# Altium schematic sheet SN原理图.SchDoc
size A2
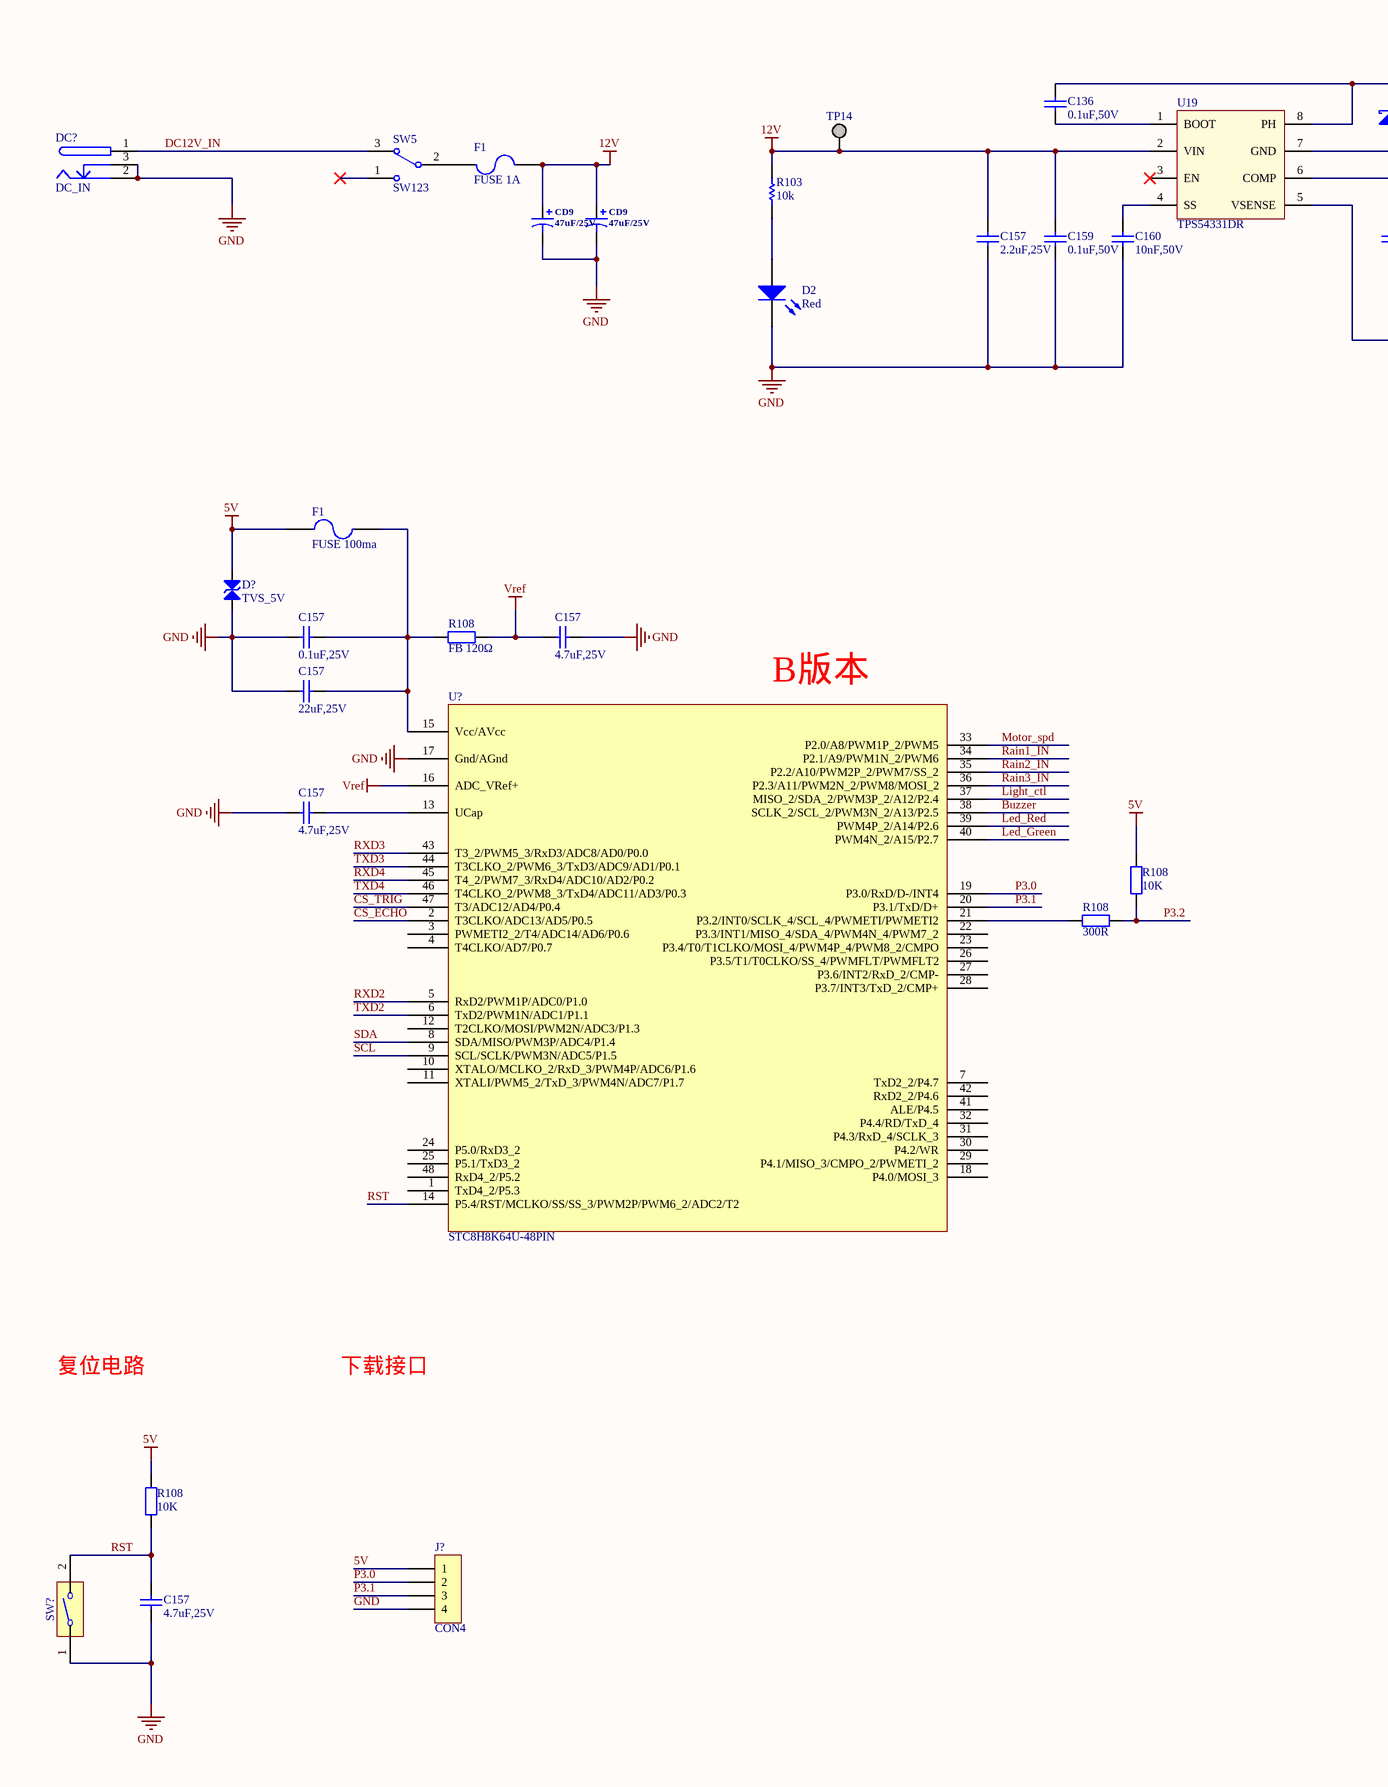
[diagram p0: SN原理图.SchDoc, left]
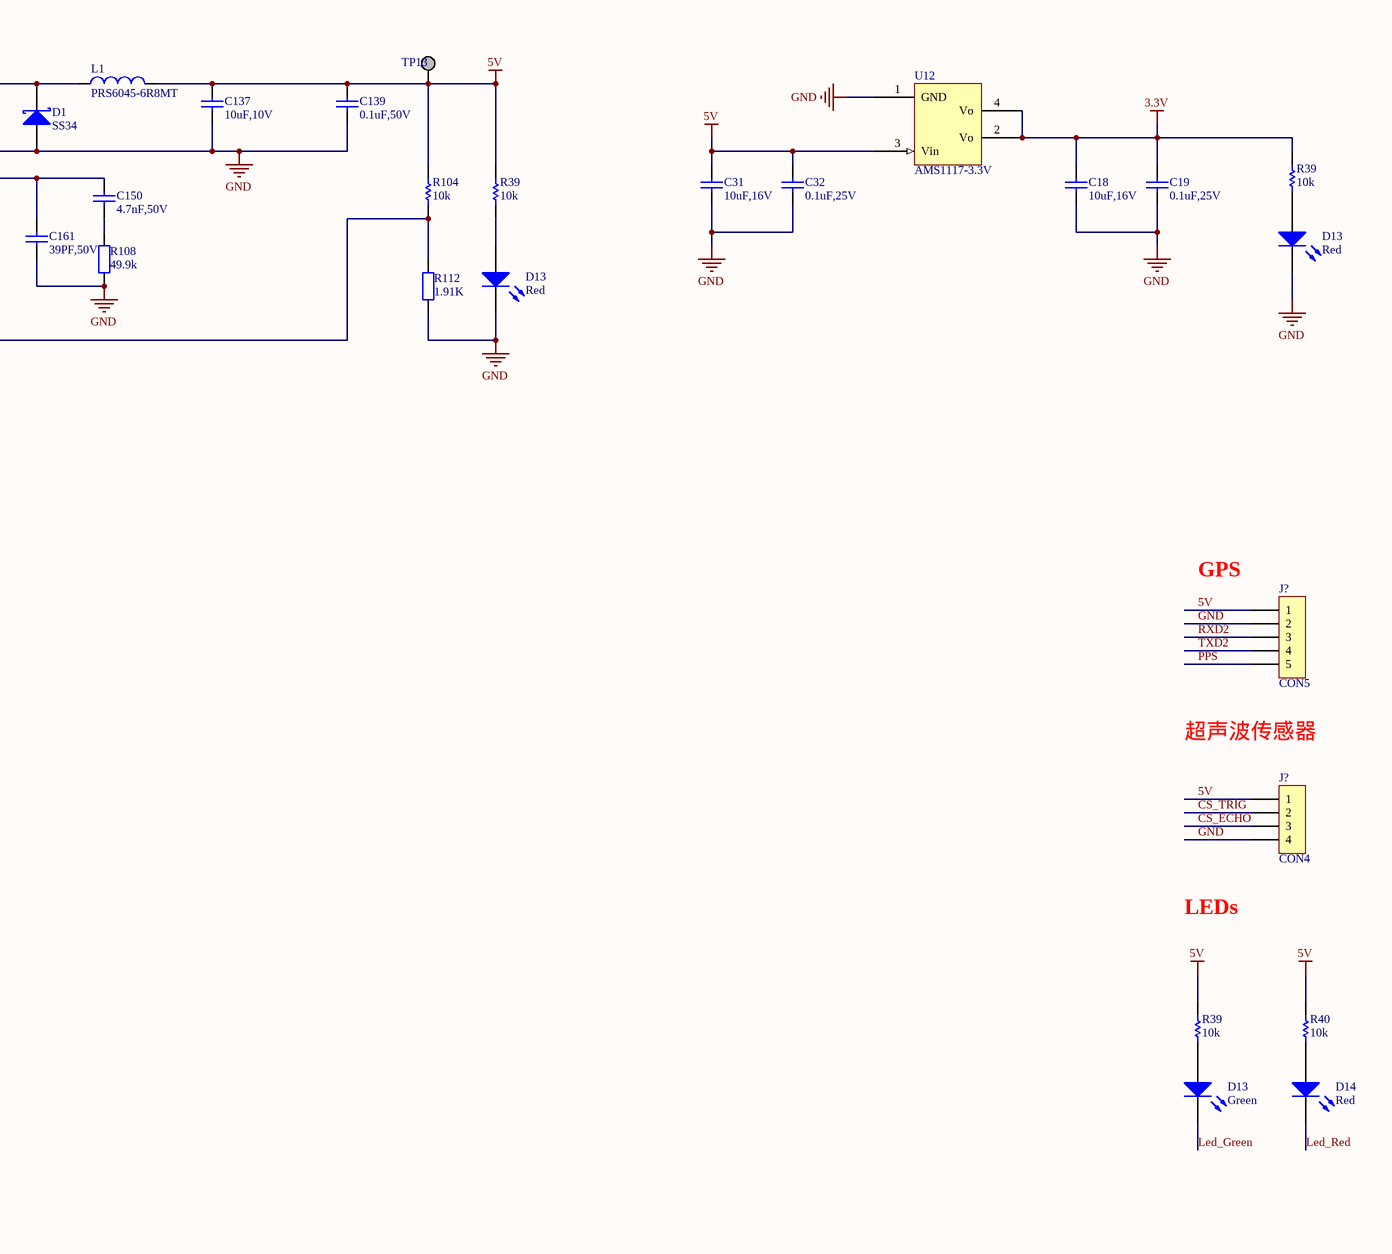
[diagram p1: SN原理图.SchDoc, right]

## Parts
(Parts that share a designator on the sheet are numbered #1, #2 ... from top to bottom, then left to right.)
C18  value 10uF,16V  [0603_C]  (hidden comment: Cap)
C19  value 0.1uF,25V  [0603_C]  (hidden comment: Cap)
C31  value 10uF,16V  [0603_C]  (hidden comment: Cap)
C32  value 0.1uF,25V  [0603_C]  (hidden comment: Cap)
C136  value 0.1uF,50V  [0603_C]  (hidden comment: Cap)
C137  value 10uF,10V  [0603_C]  (hidden comment: Cap)
C139  value 0.1uF,50V  [0603_C]  (hidden comment: Cap)
C150  value 4.7nF,50V  [0603_C]  (hidden comment: Cap)
C157#1  value 2.2uF,25V  [0603_C]  (hidden comment: Cap)
C157#2  value 0.1uF,25V  [0603_C]  (hidden comment: Cap)
C157#3  value 4.7uF,25V  [0603_C]  (hidden comment: Cap)
C157#4  value 22uF,25V  [0603_C]  (hidden comment: Cap)
C157#5  value 4.7uF,25V  [0603_C]  (hidden comment: Cap)
C157#6  value 4.7uF,25V  [0603_C]  (hidden comment: Cap)
C159  value 0.1uF,50V  [0603_C]  (hidden comment: Cap)
C160  value 10nF,50V  [0603_C]  (hidden comment: Cap)
C161  value 39PF,50V  [0603_C]  (hidden comment: Cap)
CD9#1  47uF/25V  [CD7343]
CD9#2  47uF/25V  [CD7343]
D1  value SS34  [DO-214AC]  (hidden comment: Diode Schottky)
D2  value Red  [0603_LED]  (hidden comment: LED)
D13#1  value Red  [0603_LED]  (hidden comment: LED)
D13#2  value Red  [0603_LED]  (hidden comment: LED)
D13#3  value Green  [0603_LED]  (hidden comment: LED)
D14  value Red  [0603_LED]  (hidden comment: LED)
D?  TVS_5V  [SOD-323]
DC?  DC_IN  [PJ-058A]
F1#1  FUSE 1A  [1206_FUSE]
F1#2  FUSE 100ma  [1206_FUSE]
J?#1  CON5
J?#2  CON4
J?#3  CON4
L1  value PRS6045-6R8MT  [IND-SMD_L5.8-W5.2]  (hidden comment: Inductors)
R39#1  value 10k  [0603_R]  (hidden comment: Res_5%)
R39#2  value 10k  [0603_R]  (hidden comment: Res_5%)
R39#3  value 10k  [0603_R]  (hidden comment: Res_5%)
R40  value 10k  [0603_R]  (hidden comment: Res_5%)
R103  value 10k  [0603_R]  (hidden comment: Res_5%)
R104  value 10k  [0603_R]  (hidden comment: Res_5%)
R108#1  value 49.9k  [0603_R]  (hidden comment: Res)
R108#2  value FB 120Ω  [0603_R]  (hidden comment: Res)
R108#3  value 10K  [0603_R]  (hidden comment: Res)
R108#4  value 300R  [0603_R]  (hidden comment: Res)
R108#5  value 10K  [0603_R]  (hidden comment: Res)
R112  value 1.91K  [0603_R]  (hidden comment: Res)
SW5  SW123  [SW-TH_SS-12D10L9]
SW?  (no value)
TP13  TP  [TP_H]  (value not drawn)  (no BOM)
TP14  TP  [TP_H]  (value not drawn)  (no BOM)
U12  value AMS1117-3.3V  [SOT223]  (hidden comment: AMS1117)
U19  TPS54331DR  [SOIC8]
U?  STC8H8K64U-48PIN  [QFN48(6X6mm)]

## Nets
3.3V: C18.2 C19.2 R39#1.2 U12.2(Vo) U12.4(Vo)
5V: C31.2 C32.2 C137.2 C139.2 D?.1 F1#2.2 J?#1.1 J?#2.1 J?#3.1 L1.2 R39#2.2 R39#3.2 R40.2 R104.2 R108#3.1 R108#5.1 TP13.1 U12.3(Vin)
12V: C157#1.2 C159.2 CD9#1.1 CD9#2.1 F1#1.1 R103.2 TP14.1 U19.2(VIN)
GND: C18.1 C19.1 C31.1 C32.1 C137.1 C139.1 C157#1.1 C157#2.1 C157#3.1 C157#4.1 C157#5.2 C157#6.2 C159.1 C160.2 C161.1 CD9#1.2 CD9#2.2 D1.1(A) D2.2(K) D13#1.2(K) D13#2.2(K) D?.2 DC?.2 DC?.3 J?#1.2 J?#2.4 J?#3.4 R108#1.1 R112.1 SW?.1 U12.1(GND) U19.7(GND) U?.17(Gnd/AGnd)
Vref: C157#3.2 R108#2.1 U?.16(ADC_VRef+)
Buzzer: U?.38(SCLK_2/SCL_2/PWM3N_2/A13/P2.5)
CS_ECHO: J?#2.3 U?.2(T3CLKO/ADC13/AD5/P0.5)
CS_TRIG: J?#2.2 U?.47(T3/ADC12/AD4/P0.4)
DC12V_IN: DC?.1 SW5.3
Led_Green: D13#3.2(K) U?.40(PWM4N_2/A15/P2.7)
Led_Red: D14.2(K) U?.39(PWM4P_2/A14/P2.6)
Light_ctl: U?.37(MISO_2/SDA_2/PWM3P_2/A12/P2.4)
Motor_spd: U?.33(P2.0/A8/PWM1P_2/PWM5)
P3.0: J?#3.2 U?.19(P3.0/RxD/D-/INT4)
P3.1: J?#3.3 U?.20(P3.1/TxD/D+)
P3.2: R108#3.2 R108#4.2
PPS: J?#1.5
Rain1_IN: U?.34(P2.1/A9/PWM1N_2/PWM6)
Rain2_IN: U?.35(P2.2/A10/PWM2P_2/PWM7/SS_2)
Rain3_IN: U?.36(P2.3/A11/PWM2N_2/PWM8/MOSI_2)
RST: C157#6.1 R108#5.2 SW?.2 U?.14(P5.4/RST/MCLKO/SS/SS_3/PWM2P/PWM6_2/ADC2/T2)
RXD2: J?#1.3 U?.5(RxD2/PWM1P/ADC0/P1.0)
RXD3: U?.43(T3_2/PWM5_3/RxD3/ADC8/AD0/P0.0)
RXD4: U?.45(T4_2/PWM7_3/RxD4/ADC10/AD2/P0.2)
SCL: U?.9(SCL/SCLK/PWM3N/ADC5/P1.5)
SDA: U?.8(SDA/MISO/PWM3P/ADC4/P1.4)
TXD2: J?#1.4 U?.6(TxD2/PWM1N/ADC1/P1.1)
TXD3: U?.44(T3CLKO_2/PWM6_3/TxD3/ADC9/AD1/P0.1)
TXD4: U?.46(T4CLKO_2/PWM8_3/TxD4/ADC11/AD3/P0.3)
NetC136_1: C136.1 U19.1(BOOT)
NetC136_2: C136.2 D1.2(K) L1.1 U19.8(PH)
NetC150_1: C150.1 R108#1.2
NetC150_2: C150.2 C161.2 U19.6(COMP)
NetC157#2_2: C157#2.2 C157#4.2 F1#2.1 R108#2.2 U?.15(Vcc/AVcc)
NetC157#5_1: C157#5.1 U?.13(UCap)
NetC160_1: C160.1 U19.4(SS)
NetD2_1: D2.1(A) R103.1
NetD13#1_1: D13#1.1(A) R39#1.1
NetD13#2_1: D13#2.1(A) R39#2.1
NetD13#3_1: D13#3.1(A) R39#3.1
NetD14_1: D14.1(A) R40.1
NetF1#1_2: F1#1.2 SW5.2
NetR104_1: R104.1 R112.2 U19.5(VSENSE)
NetR108#4_1: R108#4.1 U?.21(P3.2/INT0/SCLK_4/SCL_4/PWMETI/PWMETI2)

Not connected (* = marked no-connect by the designer): SW5 1*; U19 3(EN)*; U? 1(TxD4_2/P5.3) 3(PWMETI2_2/T4/ADC14/AD6/P0.6) 4(T4CLKO/AD7/P0.7) 7(TxD2_2/P4.7) 10(XTALO/MCLKO_2/RxD_3/PWM4P/ADC6/P1.6) 11(XTALI/PWM5_2/TxD_3/PWM4N/ADC7/P1.7) 12(T2CLKO/MOSI/PWM2N/ADC3/P1.3) 18(P4.0/MOSI_3) 22(P3.3/INT1/MISO_4/SDA_4/PWM4N_4/PWM7_2) 23(P3.4/T0/T1CLKO/MOSI_4/PWM4P_4/PWM8_2/CMPO) 24(P5.0/RxD3_2) 25(P5.1/TxD3_2) 26(P3.5/T1/T0CLKO/SS_4/PWMFLT/PWMFLT2) 27(P3.6/INT2/RxD_2/CMP-) 28(P3.7/INT3/TxD_2/CMP+) 29(P4.1/MISO_3/CMPO_2/PWMETI_2) 30(P4.2/WR) 31(P4.3/RxD_4/SCLK_3) 32(P4.4/RD/TxD_4) 41(ALE/P4.5) 42(RxD2_2/P4.6) 48(RxD4_2/P5.2)

## Notes on the sheet
- GPS
- (near U?) B版本
- 超声波传感器
- LEDs
- 复位电路
- 下载接口

## Library data of the parts
C18 C31 = T_Cap_0603_10uF_16V_X5R: 贴片电容; Part Typer: X5R; Solder: SMD; Withstand Voltage: 16V; Tolerance: 10%; Schematic Path: X:\Database\Schematic Library.Schlib; Part Number: T_Cap_0603_10uF_16V_X5R; LibRef: T_Cap_0603_10uF_16V_X5R
C19 C32 = T_Cap_0603_0.1uF_25V_X5R: 贴片电容; Part Typer: X5R; Solder: SMD; Withstand Voltage: 25V; Tolerance: 10%; Schematic Path: X:\Database\Schematic Library.Schlib; Part Number: T_Cap_0603_0.1uF_25V_X5R; LibRef: T_Cap_0603_0.1uF_25V_X5R
C136 C139 C159 = T_Cap_0603_0.1uF_50V_Y5V: 贴片电容; Part Typer: Y5V; Solder: SMD; Withstand Voltage: 50V; Tolerance: 20%; Schematic Path: X:\Database\Schematic Library.Schlib; Part Number: T_Cap_0603_0.1uF_50V_Y5V; LibRef: T_Cap_0603_0.1uF_50V_Y5V
C137 = T_Cap_0603_22uF_10V_X5R: 贴片电容; Part Typer: X5R; Solder: SMD; Withstand Voltage: 10V; Tolerance: 20%; Schematic Path: X:\Database\Schematic Library.Schlib; Part Number: T_Cap_0603_22uF_10V_X5R; LibRef: T_Cap_0603_22uF_10V_X5R
C150 = T_Cap_0603_4.7nF_50V_X7R: 贴片电容; Part Typer: X7R; Solder: SMD; Withstand Voltage: 50V; Tolerance: 10%; Schematic Path: X:\Database\Schematic Library.Schlib; Part Number: T_Cap_0603_4.7nF_50V_X7R; LibRef: T_Cap_0603_4.7nF_50V_X7R
C157#1-C157#6 = T_Cap_0603_2.2uF_25V_Y5V: 贴片电容; Part Typer: Y5V; Solder: SMD; Withstand Voltage: 25V; Tolerance: 20%; Schematic Path: X:\Database\Schematic Library.Schlib; Part Number: T_Cap_0603_2.2uF_25V_Y5V; LibRef: T_Cap_0603_2.2uF_25V_Y5V
C160 = T_Cap_0603_10nF_50V_X7R: 贴片电容; Part Typer: X7R; Solder: SMD; Withstand Voltage: 50V; Tolerance: 10%; Schematic Path: X:\Database\Schematic Library.Schlib; Part Number: T_Cap_0603_10nF_50V_X7R; LibRef: T_Cap_0603_10nF_50V_X7R
C161 = T_Cap_0603_39PF_50V_C0G: 贴片电容; Part Typer: C0G; Solder: SMD; Withstand Voltage: 50V; Tolerance: 5%; Schematic Path: X:\Database\Schematic Library.Schlib; Part Number: T_Cap_0603_39PF_50V_C0G; LibRef: T_Cap_0603_39PF_50V_C0G
CD9#1 CD9#2 = C-100: 钽电容,Tantalum Capacitors,47uF/16V,3.5*2.8; Published: 8-Jun-2000; LatestRevisionDate: 17-Jul-2002; LatestRevisionNote: Re-released for DXP Platform.; PackageReference: POLAR0.8; Publisher: Altium Limited
D1 = T_SS34: 肖特基二极管; Part Number: T_SS34; Solder: SMD; Schematic Path: X:\Database\Schematic Library.Schlib; LibRef: T_SS34
D2 D13#1-D13#3 D14 = T_LED_Red_0805: 红色LED灯; Solder: SMD; Schematic Path: X:\Database\Schematic Library.Schlib; Part Number: T_LED_Red_0805; LibRef: T_LED_Red_0805
D? = TBV05C: TVS,ESD二极管
DC? = DC_IN: DC插座; Supplier: *; SupplierPartNumber: *
F1#1 F1#2 = Fuse 2: Fuse; Published: 8-Jun-2000; LatestRevisionDate: 17-Jul-2002; LatestRevisionNote: Re-released for DXP Platform.; PackageReference: PIN-W2/E2.8; Publisher: Altium Limited
J?#1 = CON5: Connector
J?#2 J?#3 = CON4: Connector
L1 = T_PRS6045-6R8MT: 贴片电感; Solder: SMD; Tolerance: 20%; Rated Current: 3.8A; Schematic Path: X:\Database\Schematic Library.Schlib; Part Number: T_PRS6045-6R8MT; LibRef: T_PRS6045-6R8MT
R39#1-R39#3 R40 R103 R104 = T_Res_0603_10k_5%_1/10W: 贴片电阻; Solder: SMD; Power: 1/10W; Tolerance: 5%; Schematic Path: X:\Database\Schematic Library.Schlib; Part Number: T_Res_0603_10k_5%_1/10W; LibRef: T_Res_0603_10k_5%_1/10W
R108#1-R108#5 = T_Res_0603_49.9k_1%_1/10W: 贴片电阻; Solder: SMD; Power: 1/10W; Tolerance: 1%; Schematic Path: X:\Database\Schematic Library.Schlib; Part Number: T_Res_0603_49.9k_1%_1/10W; LibRef: T_Res_0603_49.9k_1%_1/10W
R112 = T_Res_0603_1.91k_1%_1/10W: 贴片电阻; Solder: SMD; Power: 1/10W; Tolerance: 1%; Schematic Path: X:\Database\Schematic Library.Schlib; Part Number: T_Res_0603_1.91k_1%_1/10W; LibRef: T_Res_0603_1.91k_1%_1/10W
SW5 = SW123: C319011
SW? = SW 1x SPST DIP Switch: 1 Ways SPST DIP Switch
TP13 TP14 = T_TestPoint_H: 测试点_过孔; Solder: DIP; Schematic Path: X:\Database\Schematic Library.Schlib; Part Number: T_TestPoint_H; LibRef: T_TestPoint_H
U12 = T_AMS1117-3.3V: 电源芯片; Solder: SMD; Schematic Path: X:\Database\Schematic Library.Schlib; Part Number: T_AMS1117-3.3V; LibRef: T_AMS1117-3.3V; ComponentLink2Description: Datasheet; ComponentLink2URL: X:\Database\Datasheet\AMS1117.pdf
U19 = TPS54331: TI, 3A, 3.5-28V, Buck